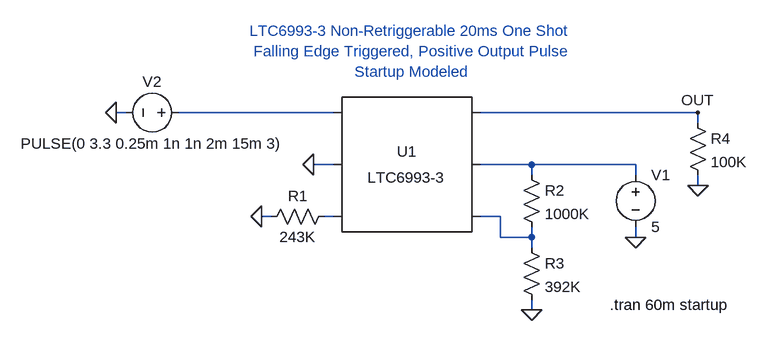
[diagram p0: schematic 6993-3.asc]
6993-3.asc, the LTspice schematic file:
Version 4
SHEET 1 880 680
WIRE -224 96 -240 96
WIRE 96 96 -144 96
WIRE 656 96 320 96
WIRE 656 112 656 96
WIRE 96 176 64 176
WIRE 400 176 320 176
WIRE 560 176 400 176
WIRE 400 192 400 176
WIRE 560 192 560 176
WIRE 656 208 656 192
WIRE 0 256 -16 256
WIRE 96 256 80 256
WIRE 352 256 320 256
WIRE 352 288 352 256
WIRE 400 288 400 272
WIRE 400 288 352 288
WIRE 560 288 560 272
WIRE 400 304 400 288
WIRE 400 400 400 384
FLAG -240 96 0
FLAG 560 288 0
FLAG 656 96 OUT
FLAG 656 208 0
FLAG 400 400 0
FLAG -16 256 0
FLAG 64 176 0
SYMBOL res 96 240 R90
WINDOW 0 0 56 VBottom 2
WINDOW 3 32 56 VTop 2
SYMATTR InstName R1
SYMATTR Value 243K
SYMBOL res 384 176 R0
SYMATTR InstName R2
SYMATTR Value 1000K
SYMBOL res 384 288 R0
SYMATTR InstName R3
SYMATTR Value 392K
SYMBOL res 640 96 R0
SYMATTR InstName R4
SYMATTR Value 100K
SYMBOL voltage 560 176 R0
WINDOW 123 0 0 Left 2
WINDOW 39 0 0 Left 2
SYMATTR InstName V1
SYMATTR Value 5
SYMBOL voltage -128 96 R90
WINDOW 123 74 56 VTop 2
WINDOW 39 53 56 VTop 2
WINDOW 3 32 56 VTop 2
WINDOW 0 -32 56 VBottom 2
SYMATTR Value PULSE(0 3.3 0.25m 1n 1n 2m 15m 3)
SYMATTR InstName V2
SYMBOL SpecialFunctions\\LTC6993-3 208 176 R0
SYMATTR InstName U1
TEXT 520 392 Left 2 !.tran 60m startup
TEXT 216 48 Bottom 2 ;LTC6993-3 Non-Retriggerable 20ms One Shot\nFalling Edge Triggered, Positive Output Pulse\nStartup Modeled

The netlist it stands for:
* 6993-3.asc
R1 N003 0 243K
R2 N002 N004 1000K
R3 N004 0 392K
R4 OUT 0 100K
V1 N002 0 5
V2 N001 0 PULSE(0 3.3 0.25m 1n 1n 2m 15m 3)
XU1 N001 0 N003 N004 N002 OUT LTC6993-3
.tran 60m startup
* LTC6993-3 Non-Retriggerable 20ms One Shot
* Falling Edge Triggered, Positive Output Pulse
* Startup Modeled
.lib LTC6993-3.sub
.backanno
.end